# Altium schematic sheet Sheet1.SchDoc
size A3
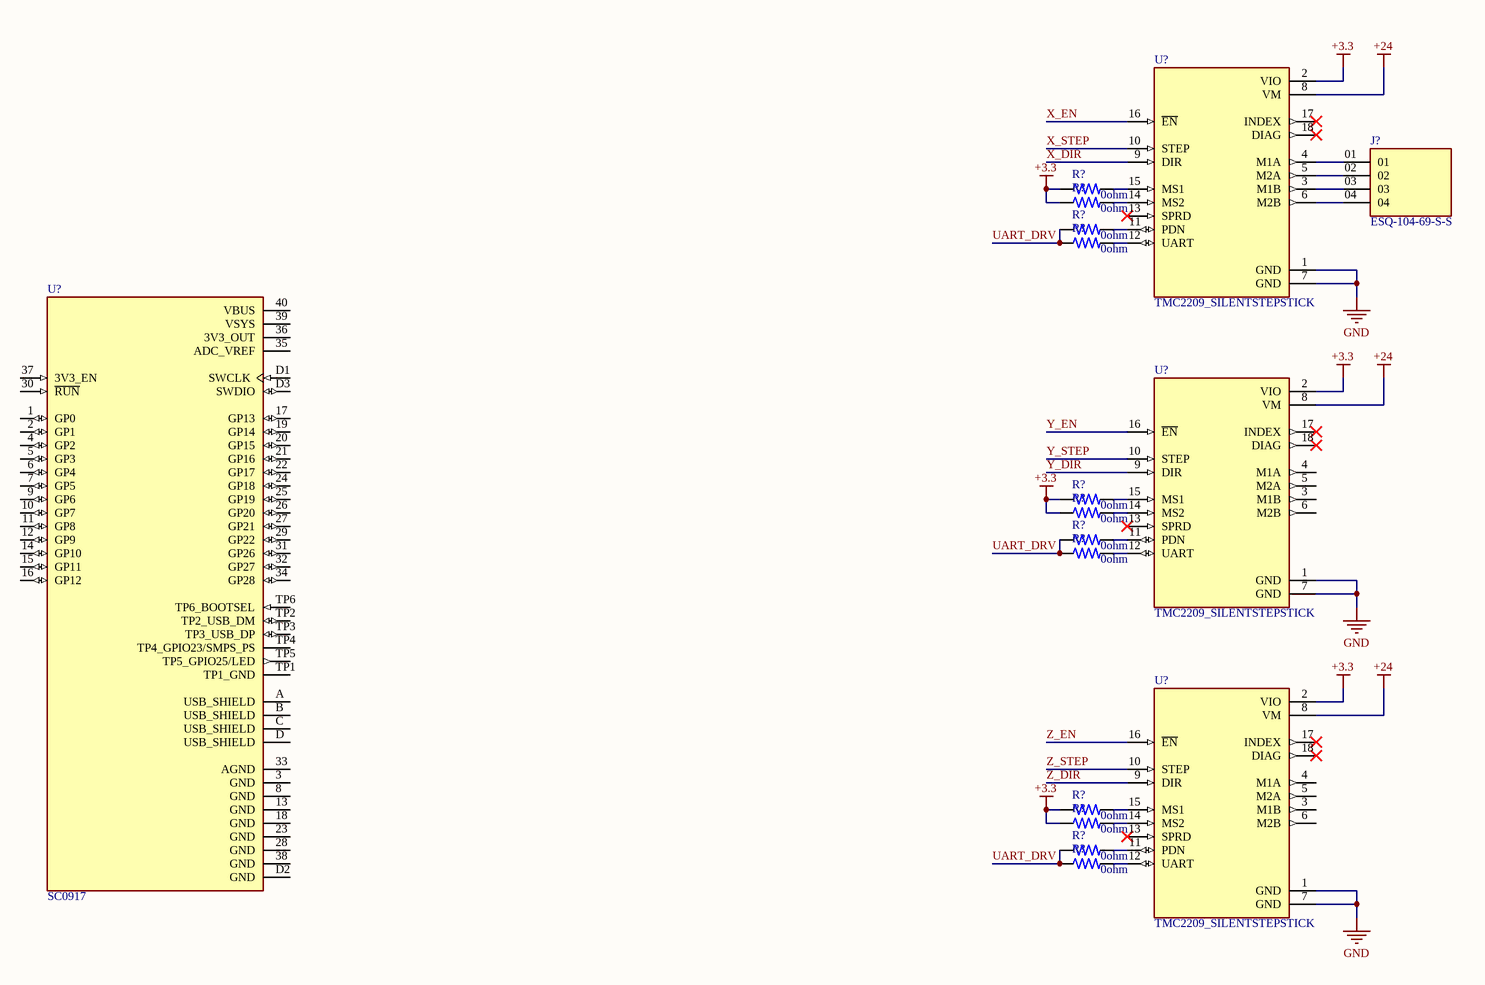
[diagram p0: Sheet1.SchDoc]

## Parts
(Parts that share a designator on the sheet are numbered #1, #2 ... from top to bottom, then left to right.)
J?  ESQ-104-69-S-S  [SAMTEC_ESQ-104-69-S-S]
R?#1  0ohm  [RESC2012X65N]
R?#2  0ohm  [RESC2012X65N]
R?#3  0ohm  [RESC2012X65N]
R?#4  0ohm  [RESC2012X65N]
R?#5  0ohm  [RESC2012X65N]
R?#6  0ohm  [RESC2012X65N]
R?#7  0ohm  [RESC2012X65N]
R?#8  0ohm  [RESC2012X65N]
R?#9  0ohm  [RESC2012X65N]
R?#10  0ohm  [RESC2012X65N]
R?#11  0ohm  [RESC2012X65N]
R?#12  0ohm  [RESC2012X65N]
U?#1  TMC2209_SILENTSTEPSTICK  [MODULE_TMC2209_SILENTSTEPSTICK]
U?#2  TMC2209_SILENTSTEPSTICK  [MODULE_TMC2209_SILENTSTEPSTICK]
U?#3  SC0917  [MODULE_SC0917]
U?#4  TMC2209_SILENTSTEPSTICK  [MODULE_TMC2209_SILENTSTEPSTICK]

## Nets
+3.3: R?#1.1 R?#2.1 R?#5.1 R?#6.1 R?#9.1 R?#10.1 U?#1.2(VIO) U?#2.2(VIO) U?#4.2(VIO)
+24: U?#1.8(VM) U?#2.8(VM) U?#4.8(VM)
GND: U?#1.1(GND) U?#1.7(GND) U?#2.1(GND) U?#2.7(GND) U?#4.1(GND) U?#4.7(GND)
UART_DRV: R?#3.1 R?#4.1 R?#7.1 R?#8.1 R?#11.1 R?#12.1
X_DIR: U?#1.9(DIR)
X_EN: U?#1.16(~{EN})
X_STEP: U?#1.10(STEP)
Y_DIR: U?#2.9(DIR)
Y_EN: U?#2.16(~{EN})
Y_STEP: U?#2.10(STEP)
Z_DIR: U?#4.9(DIR)
Z_EN: U?#4.16(~{EN})
Z_STEP: U?#4.10(STEP)
NetJ?_01: J?.01 U?#1.4(M1A)
NetJ?_02: J?.02 U?#1.5(M2A)
NetJ?_03: J?.03 U?#1.3(M1B)
NetJ?_04: J?.04 U?#1.6(M2B)
NetR?#1_2: R?#1.2 U?#1.15(MS1)
NetR?#2_2: R?#2.2 U?#1.14(MS2)
NetR?#3_2: R?#3.2 U?#1.11(PDN)
NetR?#4_2: R?#4.2 U?#1.12(UART)
NetR?#5_2: R?#5.2 U?#2.15(MS1)
NetR?#6_2: R?#6.2 U?#2.14(MS2)
NetR?#7_2: R?#7.2 U?#2.11(PDN)
NetR?#8_2: R?#8.2 U?#2.12(UART)
NetR?#9_2: R?#9.2 U?#4.15(MS1)
NetR?#10_2: R?#10.2 U?#4.14(MS2)
NetR?#11_2: R?#11.2 U?#4.11(PDN)
NetR?#12_2: R?#12.2 U?#4.12(UART)

Not connected (* = marked no-connect by the designer): U?#1 13(SPRD)* 17(INDEX)* 18(DIAG)*; U?#2 3(M1B) 4(M1A) 5(M2A) 6(M2B) 13(SPRD)* 17(INDEX)* 18(DIAG)*; U?#3 1(GP0) 2(GP1) 3(GND) 4(GP2) 5(GP3) 6(GP4) 7(GP5) 8(GND) 9(GP6) 10(GP7) 11(GP8) 12(GP9) 13(GND) 14(GP10) 15(GP11) 16(GP12) 17(GP13) 18(GND) 19(GP14) 20(GP15) 21(GP16) 22(GP17) 23(GND) 24(GP18) 25(GP19) 26(GP20) 27(GP21) 28(GND) 29(GP22) 30(~{RUN}) 31(GP26) 32(GP27) 33(AGND) 34(GP28) 35(ADC_VREF) 36(3V3_OUT) 37(3V3_EN) 38(GND) 39(VSYS) 40(VBUS) A(USB_SHIELD) B(USB_SHIELD) C(USB_SHIELD) D(USB_SHIELD) D1(SWCLK) D2(GND) D3(SWDIO) TP1(TP1_GND) TP2(TP2_USB_DM) TP3(TP3_USB_DP) TP4(TP4_GPIO23/SMPS_PS) TP5(TP5_GPIO25/LED) TP6(TP6_BOOTSEL); U?#4 3(M1B) 4(M1A) 5(M2A) 6(M2B) 13(SPRD)* 17(INDEX)* 18(DIAG)*

## Library data of the parts
J? = ESQ-104-69-S-S: MF: {'manufacturer': u'Samtec'}; Package: None; Price: None; Value: *; MP: ESQ-104-69-S-S; Availability: Unavailable
R?#1-R?#12 = RP73PF2A100KBTDF: MF: {'manufacturer': u'TE Connectivity'}; Package: None; Price: None; Value: *; MP: RP73PF2A100KBTDF; Availability: Unavailable
U?#1 U?#2 U?#4 = TMC2209_SILENTSTEPSTICK: MF: {'manufacturer': u'Trinamic Motion Control GmbH'}; Package: None; Price: None; Value: *; MP: TMC2209_SILENTSTEPSTICK; Availability: Unavailable
U?#3 = SC0917: MF: {'manufacturer': u'Raspberry Pi'}; Package: None; Price: None; Value: *; MP: SC0917; Availability: Unavailable